# EAGLE design led_driver_v1.1 (EAGLE 7.1.0)
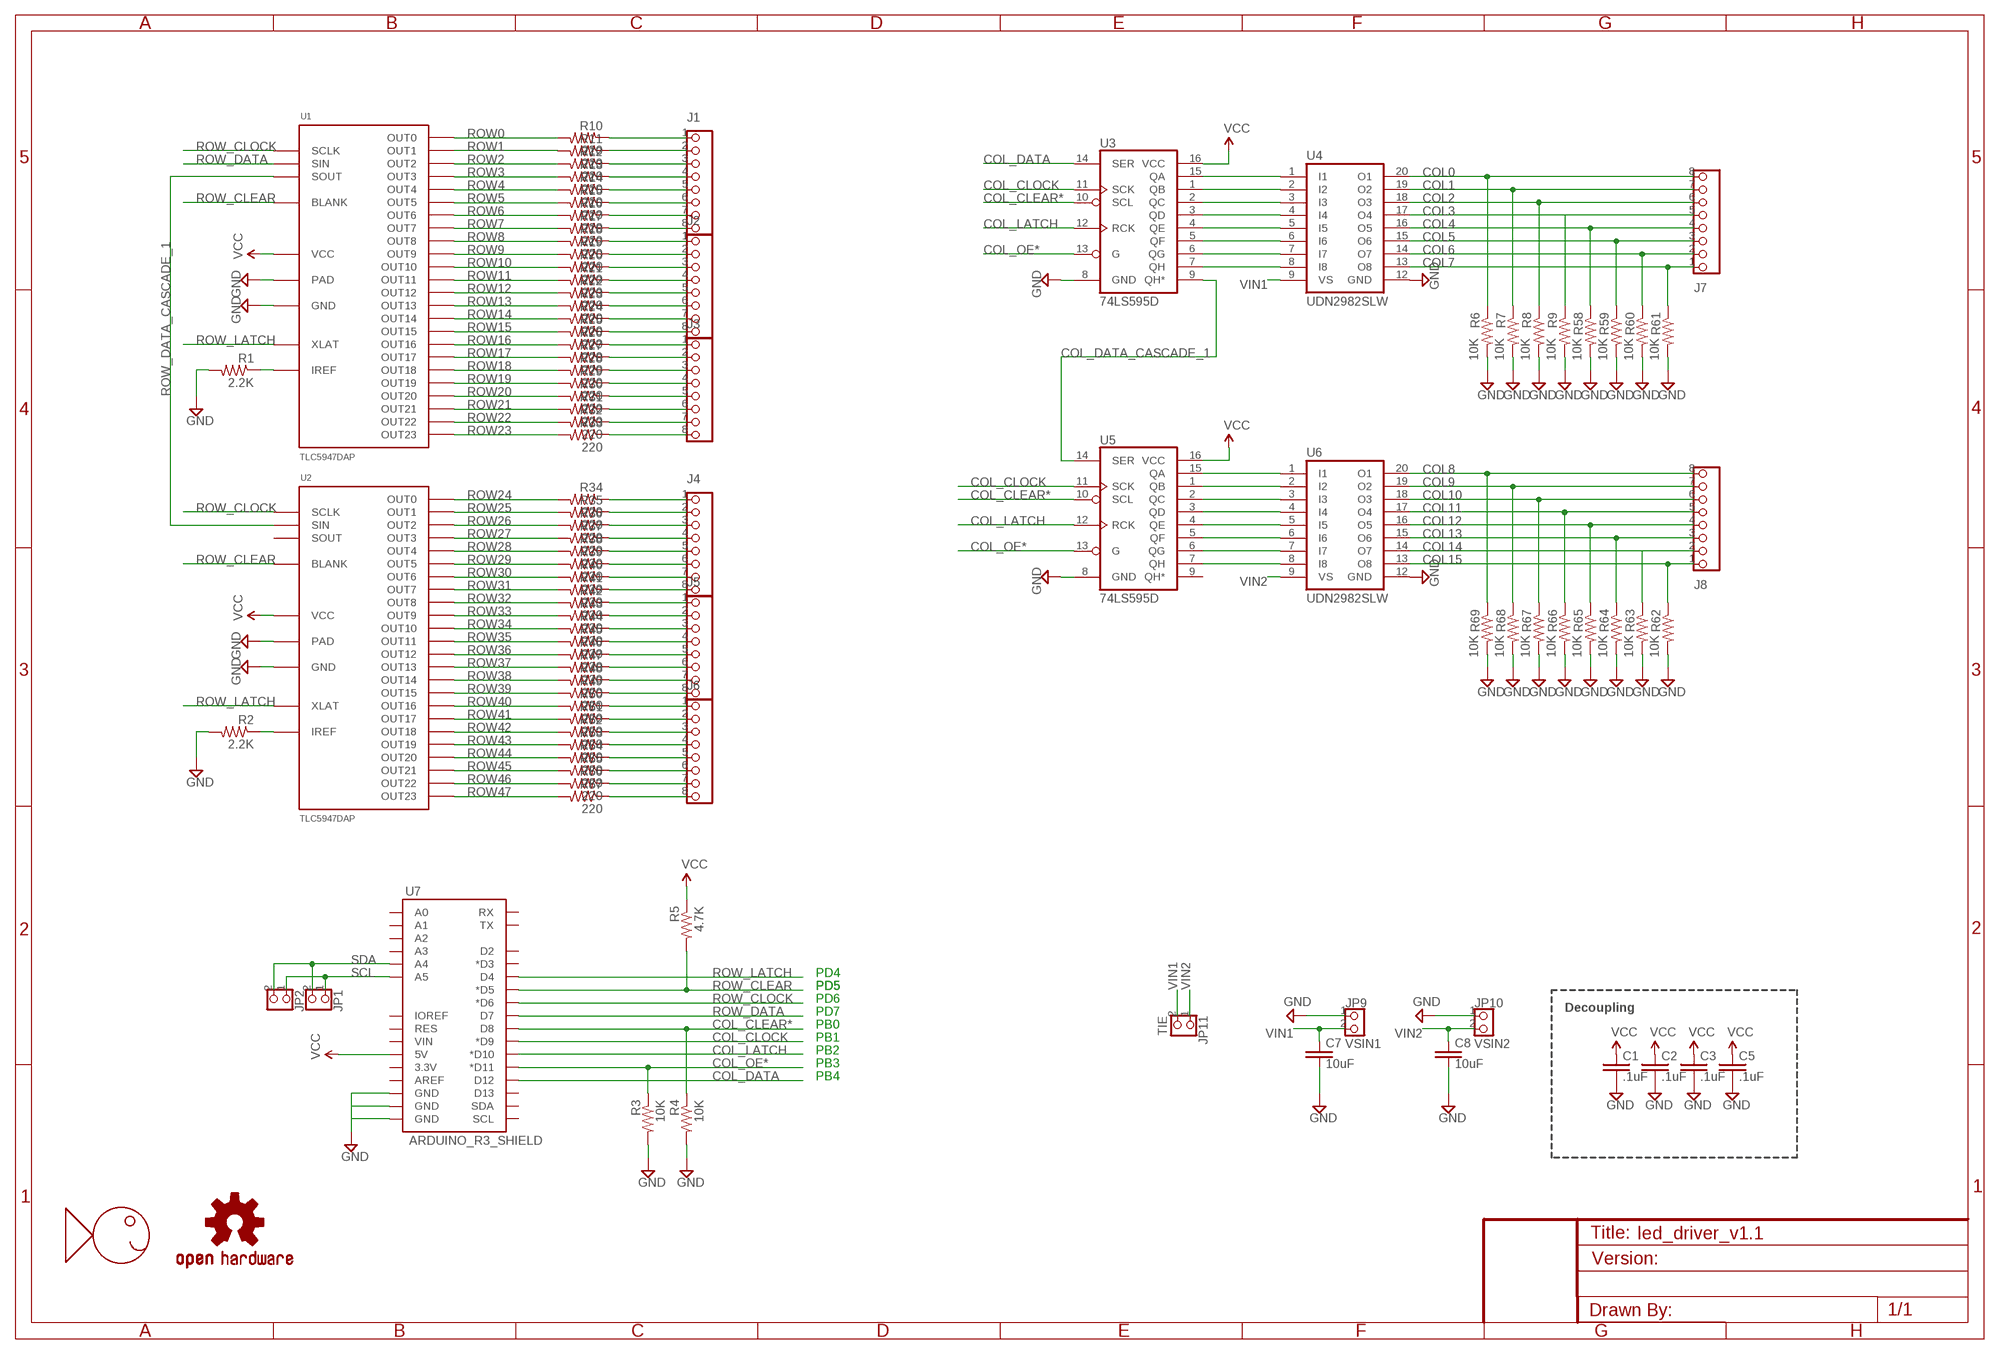
[diagram p0: schematic, sheet 1]

## Parts
C1  .1uF  CAPACITORC0603  [C0603]
C2  .1uF  CAPACITORC0603  [C0603]
C3  .1uF  CAPACITORC0603  [C0603]
C5  .1uF  CAPACITORC0603  [C0603]
C7  10uF  CAPACITORC0603  [C0603]
C8  10uF  CAPACITORC0603  [C0603]
J1  PINHD-1X8  [1X08]
J2  PINHD-1X8  [1X08]
J3  PINHD-1X8  [1X08]
J4  PINHD-1X8  [1X08]
J5  PINHD-1X8  [1X08]
J6  PINHD-1X8  [1X08]
J7  PINHD-1X8  [1X08]
J8  PINHD-1X8  [1X08]
JP1  PINHD-1X2  [1X02]
JP2  PINHD-1X2  [1X02]
JP9  VSIN1  PINHD-1X2  [1X02]
JP10  VSIN2  PINHD-1X2  [1X02]
JP11  TIE  PINHD-1X2  [1X02]
LOGO1  OSHW-LOGOS  [OSHW-LOGO-S]
R1  2.2K  RESISTOR_SMD0603-RES  [0603-RES]
R2  2.2K  RESISTOR_SMD0603-RES  [0603-RES]
R3  10K  RESISTOR_SMD0603-RES  [0603-RES]
R4  10K  RESISTOR_SMD0603-RES  [0603-RES]
R5  4.7K  RESISTOR_SMD0603-RES  [0603-RES]
R6  10K  RESISTOR_SMD0603-RES  [0603-RES]
R7  10K  RESISTOR_SMD0603-RES  [0603-RES]
R8  10K  RESISTOR_SMD0603-RES  [0603-RES]
R9  10K  RESISTOR_SMD0603-RES  [0603-RES]
R10  220  RESISTOR_SMD0603-RES  [0603-RES]
R11  220  RESISTOR_SMD0603-RES  [0603-RES]
R12  220  RESISTOR_SMD0603-RES  [0603-RES]
R13  220  RESISTOR_SMD0603-RES  [0603-RES]
R14  220  RESISTOR_SMD0603-RES  [0603-RES]
R15  220  RESISTOR_SMD0603-RES  [0603-RES]
R16  220  RESISTOR_SMD0603-RES  [0603-RES]
R17  220  RESISTOR_SMD0603-RES  [0603-RES]
R18  220  RESISTOR_SMD0603-RES  [0603-RES]
R19  220  RESISTOR_SMD0603-RES  [0603-RES]
R20  220  RESISTOR_SMD0603-RES  [0603-RES]
R21  220  RESISTOR_SMD0603-RES  [0603-RES]
R22  220  RESISTOR_SMD0603-RES  [0603-RES]
R23  220  RESISTOR_SMD0603-RES  [0603-RES]
R24  220  RESISTOR_SMD0603-RES  [0603-RES]
R25  220  RESISTOR_SMD0603-RES  [0603-RES]
R26  220  RESISTOR_SMD0603-RES  [0603-RES]
R27  220  RESISTOR_SMD0603-RES  [0603-RES]
R28  220  RESISTOR_SMD0603-RES  [0603-RES]
R29  220  RESISTOR_SMD0603-RES  [0603-RES]
R30  220  RESISTOR_SMD0603-RES  [0603-RES]
R31  220  RESISTOR_SMD0603-RES  [0603-RES]
R32  220  RESISTOR_SMD0603-RES  [0603-RES]
R33  220  RESISTOR_SMD0603-RES  [0603-RES]
R34  220  RESISTOR_SMD0603-RES  [0603-RES]
R35  220  RESISTOR_SMD0603-RES  [0603-RES]
R36  220  RESISTOR_SMD0603-RES  [0603-RES]
R37  220  RESISTOR_SMD0603-RES  [0603-RES]
R38  220  RESISTOR_SMD0603-RES  [0603-RES]
R39  220  RESISTOR_SMD0603-RES  [0603-RES]
R40  220  RESISTOR_SMD0603-RES  [0603-RES]
R41  220  RESISTOR_SMD0603-RES  [0603-RES]
R42  220  RESISTOR_SMD0603-RES  [0603-RES]
R43  220  RESISTOR_SMD0603-RES  [0603-RES]
R44  220  RESISTOR_SMD0603-RES  [0603-RES]
R45  220  RESISTOR_SMD0603-RES  [0603-RES]
R46  220  RESISTOR_SMD0603-RES  [0603-RES]
R47  220  RESISTOR_SMD0603-RES  [0603-RES]
R48  220  RESISTOR_SMD0603-RES  [0603-RES]
R49  220  RESISTOR_SMD0603-RES  [0603-RES]
R50  220  RESISTOR_SMD0603-RES  [0603-RES]
R51  220  RESISTOR_SMD0603-RES  [0603-RES]
R52  220  RESISTOR_SMD0603-RES  [0603-RES]
R53  220  RESISTOR_SMD0603-RES  [0603-RES]
R54  220  RESISTOR_SMD0603-RES  [0603-RES]
R55  220  RESISTOR_SMD0603-RES  [0603-RES]
R56  220  RESISTOR_SMD0603-RES  [0603-RES]
R57  220  RESISTOR_SMD0603-RES  [0603-RES]
R58  10K  RESISTOR_SMD0603-RES  [0603-RES]
R59  10K  RESISTOR_SMD0603-RES  [0603-RES]
R60  10K  RESISTOR_SMD0603-RES  [0603-RES]
R61  10K  RESISTOR_SMD0603-RES  [0603-RES]
R62  10K  RESISTOR_SMD0603-RES  [0603-RES]
R63  10K  RESISTOR_SMD0603-RES  [0603-RES]
R64  10K  RESISTOR_SMD0603-RES  [0603-RES]
R65  10K  RESISTOR_SMD0603-RES  [0603-RES]
R66  10K  RESISTOR_SMD0603-RES  [0603-RES]
R67  10K  RESISTOR_SMD0603-RES  [0603-RES]
R68  10K  RESISTOR_SMD0603-RES  [0603-RES]
R69  10K  RESISTOR_SMD0603-RES  [0603-RES]
U1  TLC5947DAP  [HTSSOP32DAP]
U2  TLC5947DAP  [HTSSOP32DAP]
U3  74LS595D  [SO16]
U4  UDN2982SLW  [SO20W]
U5  74LS595D  [SO16]
U6  UDN2982SLW  [SO20W]
U7  ARDUINO_R3_SHIELD  [UNO_R3_SHIELD]
U$1  FHI_LOGO  [FHI_LOGO]

## Nets
COL0: J7.8 R6.1 U4.20(O1)
COL1: J7.7 R7.1 U4.19(O2)
COL2: J7.6 R8.1 U4.18(O3)
COL3: J7.5 R9.1 U4.17(O4)
COL4: J7.4 R58.1 U4.16(O5)
COL5: J7.3 R59.1 U4.15(O6)
COL6: J7.2 R60.1 U4.14(O7)
COL7: J7.1 R61.1 U4.13(O8)
COL8: J8.8 R69.1 U6.20(O1)
COL9: J8.7 R68.1 U6.19(O2)
COL10: J8.6 R67.1 U6.18(O3)
COL11: J8.5 R66.1 U6.17(O4)
COL12: J8.4 R65.1 U6.16(O5)
COL13: J8.3 R64.1 U6.15(O6)
COL14: J8.2 R63.1 U6.14(O7)
COL15: J8.1 R62.1 U6.13(O8)
COL_CLEAR*: R4.1 U3.10(SCL) U5.10(SCL) U7.D8
COL_CLOCK: U3.11(SCK) U5.11(SCK) U7.D9(*D9)
COL_DATA: U3.14(SER) U7.D12
COL_DATA_CASCADE_1: U3.9(QH*) U5.14(SER)
COL_LATCH: U3.12(RCK) U5.12(RCK) U7.D10(*D10)
COL_OE*: R3.1 U3.13(G) U5.13(G) U7.D11(*D11)
GND: C1.2 C2.2 C3.2 C5.2 C7.2 C8.2 JP9.1 JP10.1 R1.2 R2.2 R3.2 R4.2 R6.2 R7.2 R8.2 R9.2 R58.2 R59.2 R60.2 R61.2 R62.2 R63.2 R64.2 R65.2 R66.2 R67.2 R68.2 R69.2 U1.1(GND) U1.EXP(PAD) U2.1(GND) U2.EXP(PAD) U3.8(GND) U4.12(GND) U5.8(GND) U6.12(GND) U7.GND@0(GND) U7.GND@1(GND) U7.GND@2(GND)
N$1: U3.15(QA) U4.1(I1)
N$2: U3.1(QB) U4.2(I2)
N$3: U3.2(QC) U4.3(I3)
N$4: U3.3(QD) U4.4(I4)
N$5: U3.4(QE) U4.5(I5)
N$6: U3.5(QF) U4.6(I6)
N$7: U3.6(QG) U4.7(I7)
N$8: U3.7(QH) U4.8(I8)
N$9: J1.1 R10.1
N$10: U5.15(QA) U6.1(I1)
N$11: U5.1(QB) U6.2(I2)
N$12: U5.2(QC) U6.3(I3)
N$13: U5.3(QD) U6.4(I4)
N$14: U5.4(QE) U6.5(I5)
N$15: U5.5(QF) U6.6(I6)
N$16: U5.6(QG) U6.7(I7)
N$17: U5.7(QH) U6.8(I8)
N$19: J1.7 R16.1
N$20: J1.8 R17.1
N$21: J2.1 R18.1
N$22: J2.2 R19.1
N$23: J2.3 R20.1
N$24: J1.6 R15.1
N$25: J2.4 R21.1
N$26: J2.5 R22.1
N$27: J2.6 R23.1
N$28: R2.1 U2.31(IREF)
N$29: J2.7 R24.1
N$30: J2.8 R25.1
N$31: J3.1 R26.1
N$32: J3.2 R27.1
N$33: J3.3 R28.1
N$34: J3.4 R29.1
N$35: R1.1 U1.31(IREF)
N$36: J3.5 R30.1
N$37: J3.6 R31.1
N$38: J3.7 R32.1
N$39: J3.8 R33.1
N$40: J1.2 R11.1
N$41: J1.3 R12.1
N$42: J1.4 R13.1
N$43: J1.5 R14.1
N$44: J6.7 R56.1
N$45: J6.8 R57.1
N$46: J6.6 R55.1
N$47: J6.5 R54.1
N$48: J6.4 R53.1
N$49: J6.3 R52.1
N$50: J6.2 R51.1
N$51: J6.1 R50.1
N$52: J5.8 R49.1
N$53: J5.7 R48.1
N$54: J5.6 R47.1
N$55: J5.5 R46.1
N$56: J5.4 R45.1
N$57: J5.3 R44.1
N$58: J5.2 R43.1
N$59: J5.1 R42.1
N$60: J4.8 R41.1
N$61: J4.7 R40.1
N$62: J4.6 R39.1
N$63: J4.5 R38.1
N$64: J4.4 R37.1
N$65: J4.3 R36.1
N$66: J4.2 R35.1
N$67: J4.1 R34.1
ROW0: R10.2 U1.5(OUT0)
ROW1: R11.2 U1.6(OUT1)
ROW2: R12.2 U1.7(OUT2)
ROW3: R13.2 U1.8(OUT3)
ROW4: R14.2 U1.9(OUT4)
ROW5: R15.2 U1.10(OUT5)
ROW6: R16.2 U1.11(OUT6)
ROW7: R17.2 U1.12(OUT7)
ROW8: R18.2 U1.13(OUT8)
ROW9: R19.2 U1.14(OUT9)
ROW10: R20.2 U1.15(OUT10)
ROW11: R21.2 U1.16(OUT11)
ROW12: R22.2 U1.17(OUT12)
ROW13: R23.2 U1.18(OUT13)
ROW14: R24.2 U1.19(OUT14)
ROW15: R25.2 U1.20(OUT15)
ROW16: R26.2 U1.21(OUT16)
ROW17: R27.2 U1.22(OUT17)
ROW18: R28.2 U1.23(OUT18)
ROW19: R29.2 U1.24(OUT19)
ROW20: R30.2 U1.25(OUT20)
ROW21: R31.2 U1.26(OUT21)
ROW22: R32.2 U1.27(OUT22)
ROW23: R33.2 U1.28(OUT23)
ROW24: R34.2 U2.5(OUT0)
ROW25: R35.2 U2.6(OUT1)
ROW26: R36.2 U2.7(OUT2)
ROW27: R37.2 U2.8(OUT3)
ROW28: R38.2 U2.9(OUT4)
ROW29: R39.2 U2.10(OUT5)
ROW30: R40.2 U2.11(OUT6)
ROW31: R41.2 U2.12(OUT7)
ROW32: R42.2 U2.13(OUT8)
ROW33: R43.2 U2.14(OUT9)
ROW34: R44.2 U2.15(OUT10)
ROW35: R45.2 U2.16(OUT11)
ROW36: R46.2 U2.17(OUT12)
ROW37: R47.2 U2.18(OUT13)
ROW38: R48.2 U2.19(OUT14)
ROW39: R49.2 U2.20(OUT15)
ROW40: R50.2 U2.21(OUT16)
ROW41: R51.2 U2.22(OUT17)
ROW42: R52.2 U2.23(OUT18)
ROW43: R53.2 U2.24(OUT19)
ROW44: R54.2 U2.25(OUT20)
ROW45: R55.2 U2.26(OUT21)
ROW46: R56.2 U2.27(OUT22)
ROW47: R57.2 U2.28(OUT23)
ROW_CLEAR: R5.2 U1.2(BLANK) U2.2(BLANK) U7.D5(*D5)
ROW_CLOCK: U1.3(SCLK) U2.3(SCLK) U7.D6(*D6)
ROW_DATA: U1.4(SIN) U7.D7
ROW_DATA_CASCADE_1: U1.29(SOUT) U2.4(SIN)
ROW_LATCH: U1.30(XLAT) U2.30(XLAT) U7.D4
SCL: JP1.1 JP2.1 U7.A5
SDA: JP1.2 JP2.2 U7.A4
VCC: C1.1 C2.1 C3.1 C5.1 R5.1 U1.32(VCC) U2.32(VCC) U3.16(VCC) U5.16(VCC) U7.5V
VIN1: C7.1 JP9.2 JP11.2 U4.9(VS)
VIN2: C8.1 JP10.2 JP11.1 U6.9(VS)
Unconnected: U2.29(SOUT) U5.9(QH*) U7.3.3V U7.A0 U7.A1 U7.A2 U7.A3 U7.AREF U7.D2 U7.D3(*D3) U7.D13 U7.IOREF U7.RES U7.RX U7.SCL U7.SDA U7.TX U7.VIN

## Notes on the sheet
- PD4
- PD5 | PD5
- PD6 | Decoupling
- PD7
- PB0
- PB1
- PB2
- PB3
- PB4

## Library data of the parts
C1-C3 C5 C7 C8 = CyberRailGuru:CAPACITOR: CAPACITOR, American symbol
J1-J8 = CyberRailGuru:PINHD-1X8: PIN HEADER
JP1 JP2 JP9-JP11 = CyberRailGuru:PINHD-1X2: PIN HEADER
LOGO1 = SparkFun-Aesthetics:OSHW-LOGO: Open Source Hardware Logo This logo indicates the piece of hardware it is found on incorporates a OSHW license and/or adheres to the definition of open source hardware found here: http://freedomdefined.org/OSHW
R1-R69 = CyberRailGuru:RESISTOR_SMD: Resistor Basic schematic elements and footprints for 0603, 1206, and PTH resistors.
U1 U2 = CyberRailGuru:TLC5947
U3 U5 = CyberRailGuru:74*595: 8-bit SHIFT REGISTER, output latch; PROD_ID: IC-07875
U4 U6 = CyberRailGuru:UDN298*: DRIVER ARRAY Source: Allegro Microsystems Inc. / UDN2981-UDN2984.pdf
U7 = CyberRailGuru:ARDUINO_R3_SHIELD: Shield form compatible with the Arduino Uno R3.
U$1 = CyberRailGuru:FHI_LOGO: Fishhead Industries Logo

## Board
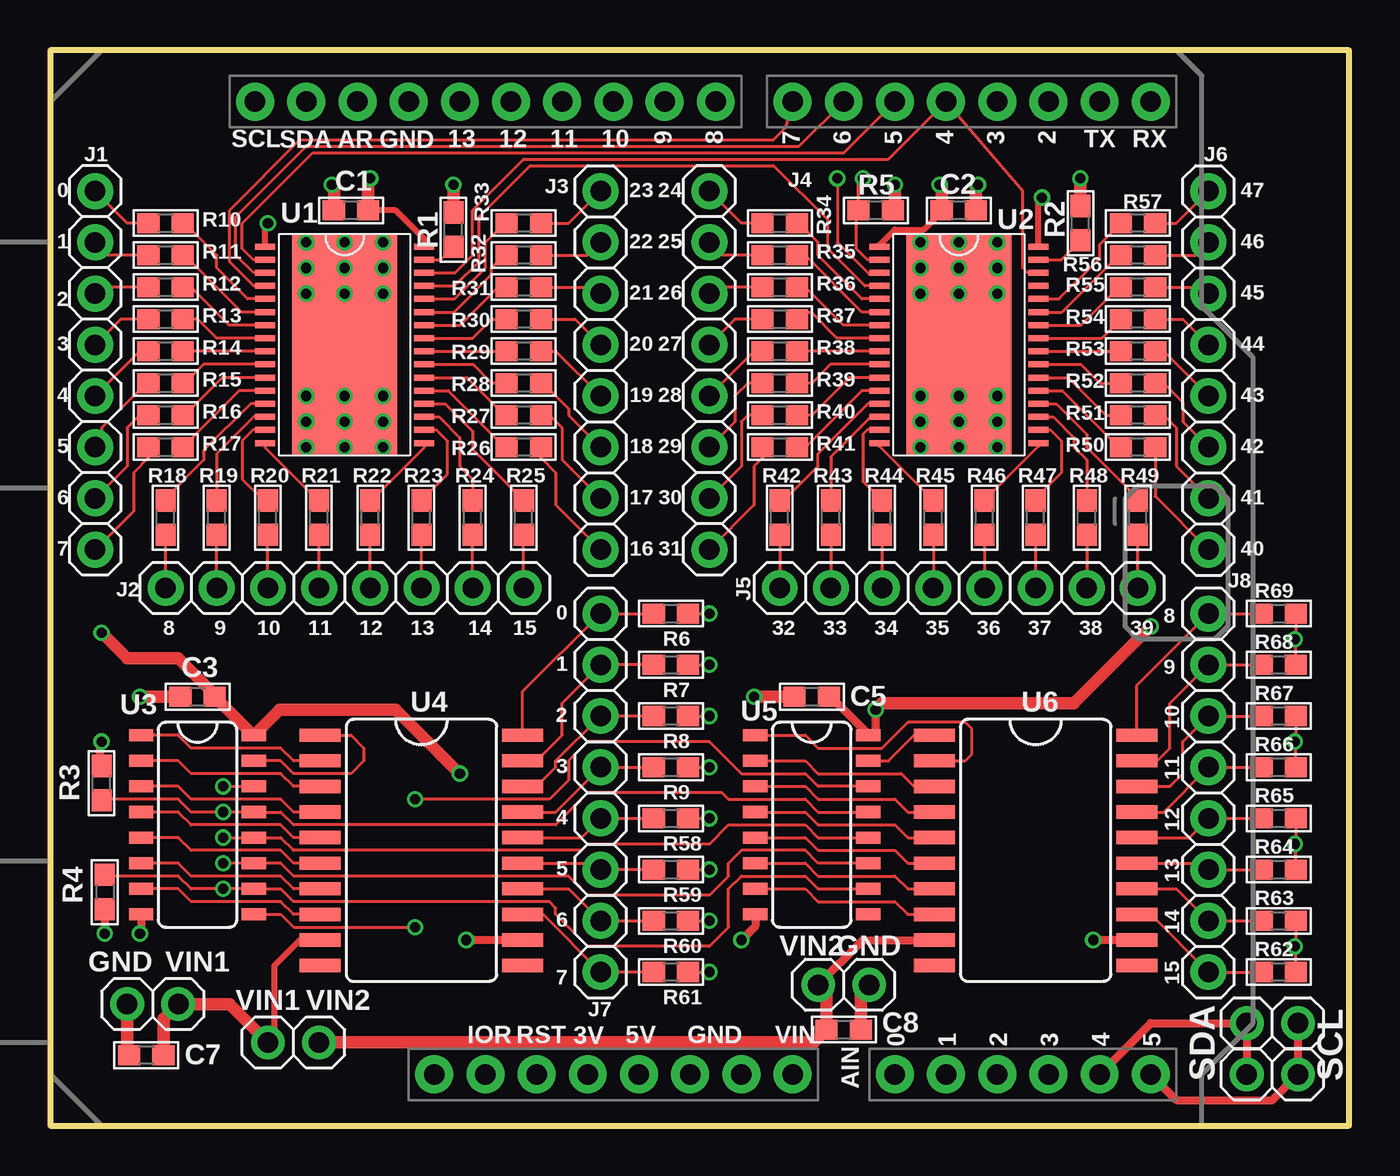
[diagram p1: board, top side]
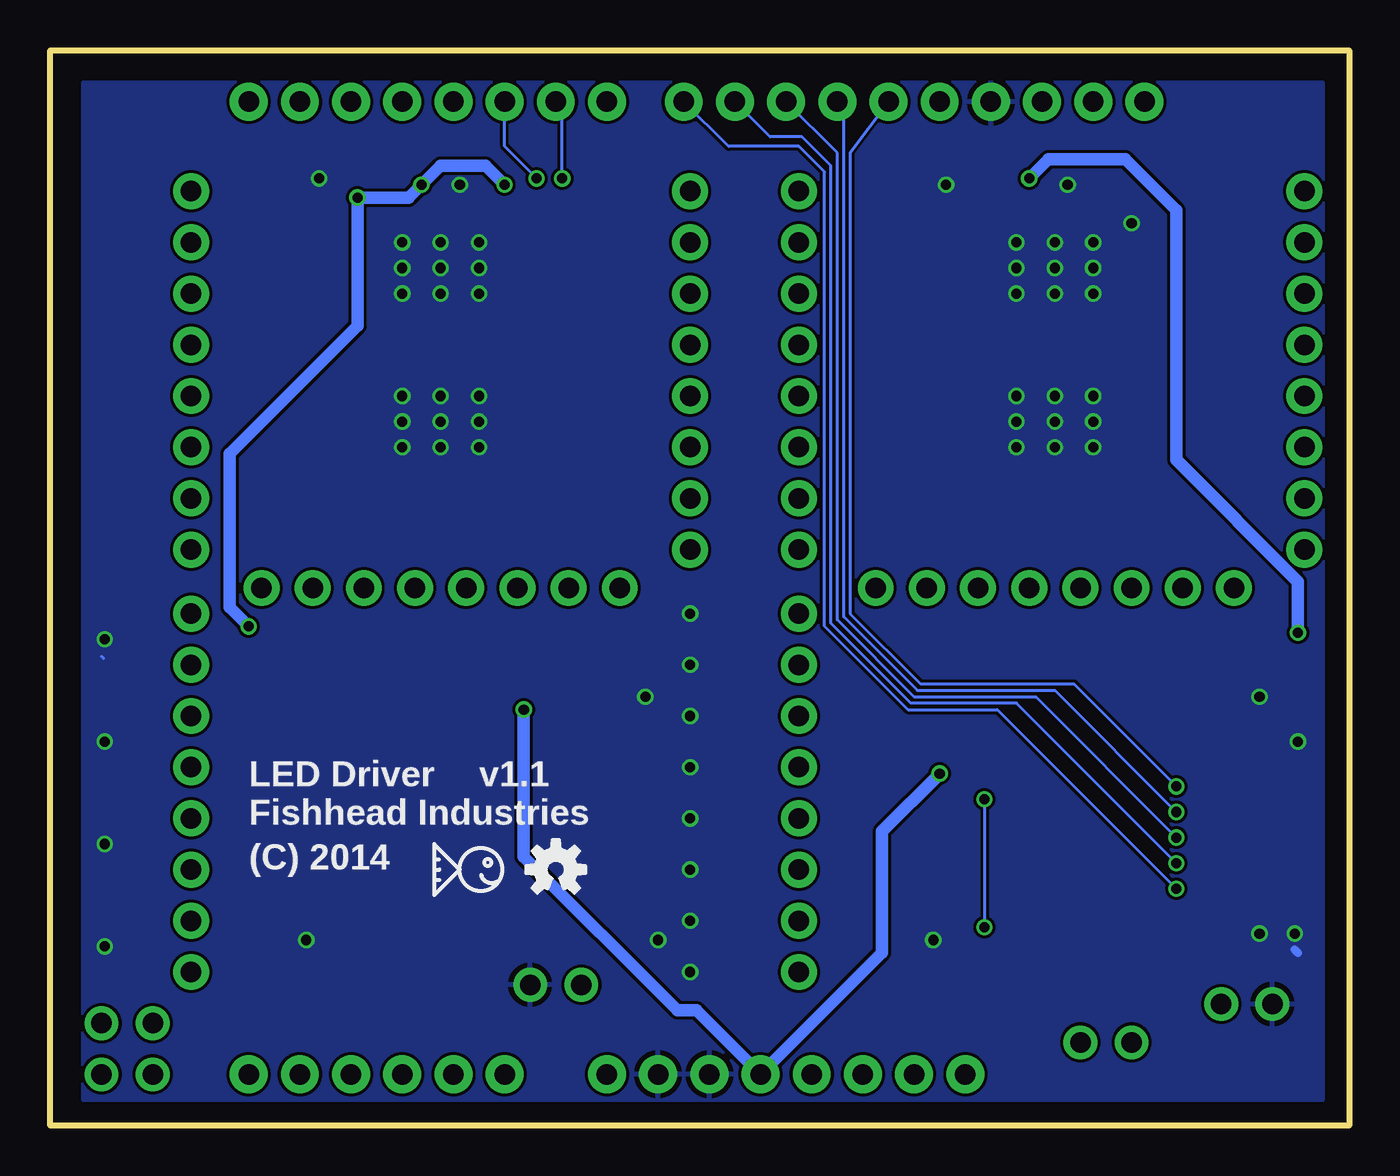
[diagram p2: board, bottom side, seen from below]

Size 64.45 x 53.34 mm. Coordinates in mm from the lower left corner, seen from the top.
Outline: 0,0 64.45,0 64.45,53.34 0,53.34 0,0
Copper layers (1*16): Top 0.035mm / dielectric 1.5mm / Bottom 0.035mm
Design rules "Fusion_eagle_rule_v1.1_tms *": minimum track width 6mil, minimum drill 12mil, track to track 6mil, track to pad 6mil, pad to pad 6mil, via to via 10mil, smd to smd 0mil, copper to edge 15mil, drill to drill 15mil, minimum pad ring 10mil, minimum via ring 6mil, stop-mask expansion 2mil, vias tented up to drill 100mil, thermal gap 10mil

### Footprints (pad centres in the part's own frame; a part is rotated, then mirrored left to right if it is on the bottom)
C0603 = smd 1.1 x 1: 1 -0.85,0; 2 0.85,0
1X08 = drill 1.016 pad 1.778: 1 -8.89,0; 2 -6.35,0; 3 -3.81,0; 4 -1.27,0; 5 1.27,0; 6 3.81,0; 7 6.35,0; 8 8.89,0
1X02 = drill 1.016 pad 1.676: 1 -1.27,0; 2 1.27,0
0603-RES = smd 1.1 x 1: 1 -0.85,0; 2 0.85,0
HTSSOP32DAP = smd 0.3 x 1: 1 -4.875,-3.95; 2 -4.225,-3.95; 3 -3.575,-3.95; 4 -2.925,-3.95; 5 -2.275,-3.95; 6 -1.625,-3.95; 7 -0.975,-3.95; 8 -0.325,-3.95; 9 0.325,-3.95; 10 0.975,-3.95; 11 1.625,-3.95; 12 2.275,-3.95; 13 2.925,-3.95; 14 3.575,-3.95; 15 4.225,-3.95; 16 4.875,-3.95; 17 4.875,3.95; 18 4.225,3.95; 19 3.575,3.95; 20 2.925,3.95; 21 2.275,3.95; 22 1.625,3.95; 23 0.975,3.95; 24 0.325,3.95; 25 -0.325,3.95; 26 -0.975,3.95; 27 -1.625,3.95; 28 -2.275,3.95; 29 -2.925,3.95; 30 -3.575,3.95; 31 -4.225,3.95; 32 -4.875,3.95 | smd 11 x 5.2: EXP 0,0
SO16 = smd 0.6 x 1.2: 1 -4.445,-2.8; 2 -3.175,-2.8; 3 -1.905,-2.8; 4 -0.635,-2.8; 5 0.635,-2.8; 6 1.905,-2.8; 7 3.175,-2.8; 8 4.445,-2.8; 9 4.445,2.8; 10 3.175,2.8; 11 1.905,2.8; 12 0.635,2.8; 13 -0.635,2.8; 14 -1.905,2.8; 15 -3.175,2.8; 16 -4.445,2.8
SO20W = smd 0.66 x 2.032: 1 -5.715,-5.029; 2 -4.445,-5.029; 3 -3.175,-5.029; 4 -1.905,-5.029; 5 -0.635,-5.029; 6 0.635,-5.029; 7 1.905,-5.029; 8 3.175,-5.029; 9 4.445,-5.029; 10 5.715,-5.029; 11 5.715,5.029; 12 4.445,5.029; 13 3.175,5.029; 14 1.905,5.029; 15 0.635,5.029; 16 -0.635,5.029; 17 -1.905,5.029; 18 -3.175,5.029; 19 -4.445,5.029; 20 -5.715,5.029
UNO_R3_SHIELD = drill 1.016 pad 1.88: 3.3V 50.8,26.67; 5V 50.8,29.21; A0 50.8,41.91; A1 50.8,44.45; A2 50.8,46.99; A3 50.8,49.53; A4 50.8,52.07; A5 50.8,54.61; AREF 2.54,15.24; D2 2.54,49.53; D3 2.54,46.99; D4 2.54,44.45; D5 2.54,41.91; D6 2.54,39.37; D7 2.54,36.83; D8 2.54,33.02; D9 2.54,30.48; D10 2.54,27.94; D11 2.54,25.4; D12 2.54,22.86; D13 2.54,20.32; GND@0 50.8,31.75; GND@1 50.8,34.29; GND@2 2.54,17.78; IOREF 50.8,21.59; NC 50.8,19.05; RES 50.8,24.13; RX 2.54,54.61; SCL 2.54,10.16; SDA 2.54,12.7; TX 2.54,52.07; VIN 50.8,36.83

### Placement (x,y rotation side)
C1  14.92,45.4 180 top
C2  45.09,45.4 180 top
C3  7.3,21.27 180 top
C5  37.78,21.27 180 top
C7  4.76,3.49 180 top
C8  39.37,4.76 0 top
J1  2.22,37.47 270 top
J2  14.61,26.67 0 top
J3  27.3,37.47 90 top
J4  32.7,37.47 270 top
J5  45.09,26.67 0 top
J6  57.47,37.47 90 top
J7  27.3,16.51 90 top
J8  57.47,16.51 90 top
JP1  60.64,5.08 180 top
JP2  60.64,2.54 180 top
JP9  5.08,6.03 0 top
JP10  39.37,6.99 180 top
JP11  12.06,4.13 180 top
LOGO1  39.37,12.7 0 bottom
R1  20,44.45 90 top
R2  51.12,44.77 90 top
R3  2.54,16.99 90 top
R4  2.7,11.59 270 top
R5  40.96,45.4 180 top
R6  30.8,25.4 0 top
R7  30.8,22.86 0 top
R8  30.8,20.32 0 top
R9  30.8,17.78 0 top
R10  5.71,44.77 0 top
R11  5.71,43.18 0 top
R12  5.71,41.59 0 top
R13  5.71,40.01 0 top
R14  5.71,38.42 0 top
R15  5.71,36.83 0 top
R16  5.71,35.24 0 top
R17  5.71,33.66 0 top
R18  5.71,30.16 90 top
R19  8.26,30.16 90 top
R20  10.79,30.16 90 top
R21  13.34,30.16 90 top
R22  15.88,30.16 90 top
R23  18.41,30.16 90 top
R24  20.95,30.16 90 top
R25  23.5,30.16 90 top
R26  23.5,33.66 180 top
R27  23.5,35.24 180 top
R28  23.5,36.83 180 top
R29  23.5,38.42 180 top
R30  23.5,40.01 180 top
R31  23.5,41.59 180 top
R32  23.5,43.18 180 top
R33  23.5,44.77 180 top
R34  36.2,44.77 0 top
R35  36.2,43.18 0 top
R36  36.2,41.59 0 top
R37  36.2,40.01 0 top
R38  36.2,38.42 0 top
R39  36.2,36.83 0 top
R40  36.2,35.24 0 top
R41  36.2,33.66 0 top
R42  36.2,30.16 90 top
R43  38.73,30.16 90 top
R44  41.27,30.16 90 top
R45  43.81,30.16 90 top
R46  46.35,30.16 90 top
R47  48.9,30.16 90 top
R48  51.44,30.16 90 top
R49  53.98,30.16 90 top
R50  53.98,33.66 180 top
R51  53.98,35.24 180 top
R52  53.98,36.83 180 top
R53  53.98,38.42 180 top
R54  53.98,40.01 180 top
R55  53.98,41.59 180 top
R56  53.98,43.18 180 top
R57  53.98,44.77 180 top
R58  30.8,15.24 0 top
R59  30.8,12.7 0 top
R60  30.8,10.16 0 top
R61  30.8,7.62 0 top
R62  60.96,7.62 0 top
R63  60.96,10.16 0 top
R64  60.96,12.7 0 top
R65  60.96,15.24 0 top
R66  60.96,17.78 0 top
R67  60.96,20.32 0 top
R68  60.96,22.86 0 top
R69  60.96,25.4 0 top
U1  14.61,38.73 270 top
U2  45.09,38.73 270 top
U3  7.3,14.92 270 top
U4  18.41,13.65 270 top
U5  37.78,14.92 270 top
U6  48.9,13.65 270 top
U7  0,53.34 270 top
U$1  44.13,12.7 0 bottom

### Tracks (layer width: path | path; a pad name or v marks a point on that pad's centre or on a via)
COL0
  Top 0.152: R6.1 J7.8 23.44,21.54 U4.20
COL1
  Top 0.152: R7.1 J7.7 25.4,20.95 25.4,19.37 24.13,18.1 U4.19
COL2
  Top 0.152: R8.1 J7.6 25.08,18.1 25.08,17.78 24.13,16.83 U4.18
COL3
  Top 0.152: R9.1 J7.5 25.08,15.56 U4.17
COL4
  Top 0.152: R58.1 J7.4 26.35,14.29 U4.16
COL5
  Top 0.152: R59.1 J7.3 26.99,13.02 U4.15
COL6
  Top 0.152: R60.1 J7.2 25.72,11.75 U4.14
COL7
  Top 0.152: R61.1 J7.1 24.45,10.48 U4.13
COL8
  Top 0.152: R69.1 J8.8 53.92,21.86 U6.20
COL9
  Top 0.152: R68.1 J8.7 55.56,20.95 55.56,18.73 54.93,18.1 U6.19
COL10
  Top 0.152: R67.1 J8.6 56.2,19.05 56.2,17.46 55.56,16.83 U6.18
COL11
  Top 0.152: R66.1 J8.5 55.24,15.56 U6.17
COL12
  Top 0.152: R65.1 J8.4 56.52,14.29 U6.16
COL13
  Top 0.152: R64.1 J8.3 57.15,13.02 U6.15
COL14
  Top 0.152: R63.1 J8.2 55.88,11.75 U6.14
COL15
  Top 0.152: R62.1 J8.1 54.61,10.48 U6.13
COL_CLEAR*  (via drill 0.5)
  Top 0.152: U5.10 38.1,11.75 37.47,12.38 34.29,12.38 33.66,11.75 33.66,9.84 32.7,8.89 26.67,8.89 25.08,10.48 25.08,10.79 24.77,11.11 12.06,11.11 11.43,11.75 U3.10 v8.57,11.75 6.99,11.75 6.35,12.38 2.75,12.38 R4.1
  Bottom 0.152: v8.57,11.75 17.46,20.64 21.91,20.64 26.04,24.77 26.04,47.31 27.3,48.58 30.8,48.58 U7.D8
COL_CLOCK  (via drill 0.5)
  Top 0.152: v8.57,13.02 U3.11 11.43,13.02 12.06,12.38 25.72,12.38 26.67,11.43 32.7,11.43 33.66,12.38 33.66,13.02 34.29,13.65 37.47,13.65 38.1,13.02 U5.11
  Bottom 0.152: v8.57,13.02 16.51,20.95 21.75,20.95 25.72,24.92 25.72,47.62 27.15,49.05 28.73,49.05 U7.D9
COL_DATA  (via drill 0.5)
  Top 0.152: v8.57,16.83 U3.14
  Bottom 0.152: v8.57,16.83 13.65,21.91 21.27,21.91 24.77,25.4 24.77,48.26 U7.D12
COL_DATA_CASCADE_1  (via drill 0.5)
  Top 0.152: U3.9 11.43,10.48 12.06,9.84 v18.1,9.84 | U5.14 38.1,16.83 37.47,17.46 34.29,17.46 32.7,19.05 26.67,19.05 25.72,18.1 25.72,17.14 24.77,16.19 v18.1,16.19
  Bottom 0.152: v18.1,16.19 v18.1,9.84
COL_LATCH  (via drill 0.5)
  Top 0.152: v8.57,14.29 U3.12 11.43,14.29 12.06,13.65 26.35,13.65 26.67,13.97 32.7,13.97 33.66,14.92 37.47,14.92 38.1,14.29 U5.12
  Bottom 0.152: v8.57,14.29 15.56,21.27 21.59,21.27 25.4,25.08 25.4,48.26 U7.D10
COL_OE*  (via drill 0.5)
  Top 0.152: U5.13 38.1,15.56 37.47,16.19 33.66,16.19 33.34,16.51 26.67,16.51 25.08,14.92 12.06,14.92 11.43,15.56 U3.13 v8.57,15.56 6.99,15.56 6.35,16.19 2.6,16.19 R3.1
  Bottom 0.152: v8.57,15.56 14.61,21.59 21.43,21.59 25.08,25.24 25.08,50.48 U7.D11
GND  (via drill 0.5)
  Top 0.152: 14.61,41.91 v12.7,43.81 | 3.81,3.6 C7.2 | R65.2 61.81,14.03 v61.75,13.97 61.81,13.91 R64.2 | R63.2 61.81,8.95 v61.75,8.89 61.81,8.83 R62.2 | R66.2 61.81,18.99 v61.75,19.05 61.81,19.11 R67.2 | R68.2 61.81,24.07 v61.75,24.13 61.81,24.19 R69.2 | R61.2 v32.7,7.62 | R60.2 v32.7,10.16 | R59.2 v32.7,12.7 | R58.2 v32.7,15.24 | R9.2 v32.7,17.78 | R8.2 v32.7,20.32 | R7.2 v32.7,22.86 | R6.2 v32.7,25.4
  Top 0.305: R4.2 2.64,10.53 | R3.2 2.48,17.84 | U1.1 10.65,44.63 v10.79,44.77 | U2.1 41.13,43.67 41.91,44.45 43.34,44.45 44.23,45.35 C2.2
  Top 0.406: U4.12 v20.64,9.21 | U5.8 34.98,9.9 v34.29,9.21 | U6.12 v51.75,9.21 | 2.48,17.84 2.48,18.99 v2.54,19.05 | U3.8 4.5,9.58 v4.45,9.53 | R4.2 v2.7,9.53
  Top 0.61: 3.81,3.6 JP9.1 | C8.2 40.22,6.57 JP10.1 | C5.2 v34.92,21.27 | C1.2 14.07,46.57 v13.97,46.67 | R1.2 v20,46.67 | C3.2 v4.45,21.27 | R2.2 v51.12,46.99 | C2.2 44.23,46.57 v44.13,46.67 | U2.EXP v45.09,41.27 | U1.EXP v14.61,41.27
  Bottom 0.152: 61.91,23.28 61.81,23.18
  Bottom 0.406: 2.7,8.73 2.54,8.57
  other vias: 12.7,42.55 14.61,43.81 16.51,43.81 16.51,42.55 16.51,41.27 16.51,36.2 16.51,34.92 16.51,33.66 14.61,33.66 12.7,33.66 12.7,41.27 12.7,36.2 12.7,34.92 14.61,42.55 14.61,36.2 14.61,34.92 43.18,43.81 46.99,43.81 45.09,43.81 43.18,42.55 45.09,42.55 46.99,42.55 43.18,41.27 46.99,41.27 46.99,36.2 45.09,36.2 43.18,36.2 43.18,34.92 43.18,33.66 45.09,33.66 45.09,34.92 46.99,34.92 46.99,33.66
  pour Bottom: 1.27,51.75 62.87,51.75 62.87,1.27 1.27,1.27
N$1
  Top 0.152: U4.1 14.92,19.37 15.56,18.73 15.56,18.1 14.92,17.46 12.06,17.46 11.43,18.1 U3.15
N$2
  Top 0.152: U4.2 12.06,18.1 11.43,18.73 6.99,18.73 6.35,19.37 U3.1
N$3
  Top 0.152: U4.3 12.06,16.83 11.43,17.46 6.99,17.46 6.35,18.1 U3.2
N$4
  Top 0.152: U4.4 12.06,15.56 11.43,16.19 6.99,16.19 6.35,16.83 U3.3
N$5
  Top 0.152: U4.5 12.06,14.29 11.43,14.92 6.99,14.92 6.35,15.56 U3.4
N$6
  Top 0.152: U4.6 12.06,13.02 11.43,13.65 6.99,13.65 6.35,14.29 U3.5
N$7
  Top 0.152: U4.7 12.06,11.75 11.43,12.38 6.99,12.38 6.35,13.02 U3.6
N$8
  Top 0.152: U4.8 12.06,10.48 11.43,11.11 6.99,11.11 6.35,11.75 U3.7
N$9
  Top 0.152: R10.1 3.81,44.77 J1.1
N$10
  Top 0.152: U5.15 41.59,18.1 42.86,19.37 U6.1
N$11
  Top 0.152: U5.1 37.47,19.37 38.1,18.73 41.27,18.73 42.55,20 45.4,20 45.72,19.68 45.72,18.41 45.4,18.1 U6.2
N$12
  Top 0.152: U5.2 37.47,18.1 38.1,17.46 42.23,17.46 42.86,16.83 U6.3
N$13
  Top 0.152: U5.3 37.47,16.83 38.1,16.19 41.91,16.19 42.55,15.56 U6.4
N$14
  Top 0.152: U5.4 37.47,15.56 38.1,14.92 41.91,14.92 42.55,14.29 U6.5
N$15
  Top 0.152: U5.5 37.47,14.29 38.1,13.65 41.91,13.65 42.55,13.02 U6.6
N$16
  Top 0.152: U5.6 37.47,13.02 38.1,12.38 41.91,12.38 42.55,11.75 U6.7
N$17
  Top 0.152: U5.7 37.47,11.75 38.1,11.11 41.91,11.11 42.55,10.48 U6.8
N$19
  Top 0.152: R16.1 4.45,35.24 3.81,34.61 3.81,32.7 J1.7
N$20
  Top 0.152: R17.1 4.87,33.12 4.13,32.38 4.13,30.48 J1.8
N$21
  Top 0.152: J2.1 R18.1
N$22
  Top 0.152: J2.2 R19.1
N$23
  Top 0.152: J2.3 R20.1
N$24
  Top 0.152: R15.1 4.76,36.83 2.54,34.61 2.54,33.97 J1.6
N$25
  Top 0.152: J2.4 R21.1
N$26
  Top 0.152: J2.5 R22.1
N$27
  Top 0.152: J2.6 R23.1
N$28
  Top 0.152: R2.1 50.16,42.96 U2.31
N$29
  Top 0.152: J2.7 R24.1
N$30
  Top 0.152: J2.8 R25.1
N$31
  Top 0.152: R26.1 24.34,33.12 25.08,32.38 25.08,30.8 J3.1
N$32
  Top 0.152: R27.1 24.77,35.24 25.4,34.61 25.4,33.02 J3.2
N$33
  Top 0.152: R28.1 24.45,36.83 25.72,35.56 25.72,35.24 J3.3
N$34
  Top 0.152: R29.1 25.08,38.42 J3.4
N$35
  Top 0.152: U1.31 19.36,42.96 R1.1
N$36
  Top 0.152: R30.1 26.04,40.01 J3.5
N$37
  Top 0.152: R31.1 26.99,41.59 J3.6
N$38
  Top 0.152: R32.1 26.67,43.18 J3.7
N$39
  Top 0.152: R33.1 25.72,44.77 J3.8
N$40
  Top 0.152: R11.1 2.86,43.18 J1.2
N$41
  Top 0.152: R12.1 2.54,41.59 J1.3
N$42
  Top 0.152: R13.1 3.49,40.01 J1.4
N$43
  Top 0.152: R14.1 4.45,38.42 J1.5
N$44
  Top 0.152: R56.1 56.83,43.18 J6.7
N$45
  Top 0.152: R57.1 55.88,44.77 J6.8
N$46
  Top 0.152: R55.1 57.15,41.59 J6.6
N$47
  Top 0.152: R54.1 56.2,40.01 J6.5
N$48
  Top 0.152: R53.1 55.24,38.42 J6.4
N$49
  Top 0.152: R52.1 55.24,36.83 56.2,35.88 56.2,34.92 J6.3
N$50
  Top 0.152: R51.1 55.24,35.24 55.88,34.61 55.88,32.7 J6.2
N$51
  Top 0.152: R50.1 54.83,31.22 J6.1
N$52
  Top 0.152: J5.8 R49.1
N$53
  Top 0.152: R48.1 J5.7
N$54
  Top 0.152: J5.6 R47.1
N$55
  Top 0.152: R46.1 J5.5
N$56
  Top 0.152: R45.1 J5.4
N$57
  Top 0.152: R44.1 J5.3
N$58
  Top 0.152: R43.1 J5.2
N$59
  Top 0.152: R42.1 J5.1
N$60
  Top 0.152: R41.1 35.34,33.12 34.92,32.7 34.92,30.8 J4.8
N$61
  Top 0.152: R40.1 34.61,35.24 34.29,34.92 34.29,32.7 J4.7
N$62
  Top 0.152: R39.1 34.61,36.83 33.97,36.2 33.97,34.92 J4.6
N$63
  Top 0.152: R38.1 34.92,38.42 J4.5
N$64
  Top 0.152: R37.1 33.97,40.01 J4.4
N$65
  Top 0.152: R36.1 33.02,41.59 J4.3
N$66
  Top 0.152: R35.1 33.34,43.18 J4.2
N$67
  Top 0.152: R34.1 34.29,44.77 J4.1
ROW0
  Top 0.152: U1.5 9.79,41.01 8.26,42.55 8.26,43.18 6.67,44.77 R10.2
ROW1
  Top 0.152: U1.6 9.49,40.36 6.67,43.18 R11.2
ROW2
  Top 0.152: U1.7 8.87,39.71 6.99,41.59 R12.2
ROW3
  Top 0.152: U1.8 8.25,39.06 7.3,40.01 R13.2
ROW4
  Top 0.152: U1.9 6.57,38.41 R14.2
ROW5
  Top 0.152: U1.10 7.6,37.76 6.67,36.83 R15.2
ROW6
  Top 0.152: U1.11 8.54,37.11 6.99,35.56 6.88,35.56 R16.2
ROW7
  Top 0.152: R17.2 9.37,36.46 U1.12
ROW8
  Top 0.152: U1.13 9.93,35.81 7.62,33.5 7.62,33.02 5.71,31.11 R18.2
ROW9
  Top 0.152: U1.14 10.08,35.16 8.26,33.34 R19.2
ROW10
  Top 0.152: U1.15 10.06,34.51 9.53,33.97 9.53,32.07 10.48,31.11 10.69,31.11 R20.2
ROW11
  Top 0.152: U1.16 10.65,33.64 13.02,31.27 13.23,31.11 R21.2
ROW12
  Top 0.152: U1.17 18.55,33.64 16.03,31.11 15.98,31.11 R22.2
ROW13
  Top 0.152: U1.18 19.15,34.51 19.68,33.97 19.68,32.28 R23.2
ROW14
  Top 0.152: U1.19 19.29,35.16 20.32,34.13 20.32,32.7 20.95,32.07 R24.2
ROW15
  Top 0.152: U1.20 19.59,35.81 20.95,34.45 20.95,33.55 R25.2
ROW16
  Top 0.152: U1.21 19.74,36.46 22.54,33.66 R26.2
ROW17
  Top 0.152: U1.22 20.68,37.11 22.54,35.24 R27.2
ROW18
  Top 0.152: U1.23 20.98,37.76 21.91,36.83 R28.2
ROW19
  Top 0.152: U1.24 R29.2
ROW20
  Top 0.152: U1.25 20.96,39.06 21.91,40.01 R30.2
ROW21
  Top 0.152: U1.26 20.34,39.71 22.23,41.59 R31.2
ROW22
  Top 0.152: U1.27 20.04,40.36 21.91,42.23 21.91,42.55 22.54,43.18 R32.2
ROW23
  Top 0.152: U1.28 20.05,41.01 21.59,42.55 21.59,43.81 22.54,44.77 R33.2
ROW24
  Top 0.152: U2.5 40.27,41.01 38.1,43.18 38.1,43.81 37.15,44.77 R34.2
ROW25
  Top 0.152: U2.6 40.28,40.36 37.47,43.18 R35.2
ROW26
  Top 0.152: U2.7 39.35,39.71 37.47,41.59 R36.2
ROW27
  Top 0.152: U2.8 39.05,39.06 37.78,40.32 37.36,40.32 R37.2
ROW28
  Top 0.152: U2.9 R38.2
ROW29
  Top 0.152: U2.10 38.71,37.76 37.78,36.83 R39.2
ROW30
  Top 0.152: U2.11 39.65,37.11 37.78,35.24 R40.2
ROW31
  Top 0.152: U2.12 40.27,36.46 37.47,33.66 R41.2
ROW32
  Top 0.152: U2.13 40.57,35.81 38.1,33.34 38.1,32.7 36.41,31.01 R42.2
ROW33
  Top 0.152: U2.14 40.72,35.16 38.73,33.18 R43.2
ROW34
  Top 0.152: U2.15 40.54,34.51 40.32,34.29 40.32,31.96 R44.2
ROW35
  Top 0.152: U2.16 41.13,33.69 R45.2
ROW36
  Top 0.152: U2.17 49.03,33.69 R46.2
ROW37
  Top 0.152: U2.18 49.63,34.51 50.16,33.97 50.16,32.38 49,31.22 49,31.11 R47.2
ROW38
  Top 0.152: U2.19 49.77,35.16 50.8,34.13 50.8,33.66 51.44,33.02 R48.2
ROW39
  Top 0.152: U2.20 49.91,35.81 51.44,34.29 51.44,33.66 53.98,31.11 R49.2
ROW40
  Top 0.152: U2.21 50.22,36.46 53.02,33.66 R50.2
ROW41
  Top 0.152: U2.22 50.52,37.11 52.39,35.24 R51.2
ROW42
  Top 0.152: U2.23 51.14,37.76 52.07,36.83 R52.2
ROW43
  Top 0.152: U2.24 R53.2
ROW44
  Top 0.152: U2.25 52.18,39.06 R54.2
ROW45
  Top 0.152: 52.7,41.59 53.02,41.59 | U2.26 51.14,39.71 53.02,41.59 | 53.02,41.59 R55.2
ROW46
  Top 0.152: U2.27 50.2,40.36 53.02,43.18 R56.2
ROW47
  Top 0.152: 52.7,44.77 R57.2 52.07,43.71 52.07,43.02 50.06,41.01 U2.28
ROW_CLEAR  (via drill 0.5)
  Top 0.152: U1.2 10.06,42.96 9.53,43.5 9.53,44.77 13.02,48.26 39.37,48.26 U7.D5 | U2.2 40.54,42.96 40.01,43.5 40.01,45.4 R5.2 40.11,46.77 v40.32,46.99
  Bottom 0.152: v40.32,46.99 41.91,48.58 U7.D5
ROW_CLOCK  (via drill 0.5)
  Top 0.152: v39.05,46.99 39.05,43.81 40.64,42.23 41.05,42.23 U2.3 | U1.3 10.08,42.31 9.21,43.18 9.21,45.09 12.7,48.58 37.15,48.58 U7.D6
  Bottom 0.152: v39.05,46.99 39.05,50.48 U7.D6
ROW_DATA
  Top 0.152: U1.4 10.09,41.66 8.89,42.86 8.89,45.4 12.38,48.9 35.88,48.9 36.51,49.53 U7.D7
ROW_DATA_CASCADE_1
  Top 0.152: U1.29 20.07,41.66 21.27,42.86 21.27,45.09 23.81,47.62 35.88,47.62 38.58,44.93 38.58,43.5 40.41,41.66 U2.4
ROW_LATCH
  Top 0.152: U1.30 20.09,42.31 20.95,43.18 20.95,45.4 23.5,47.94 41.59,47.94 U7.D4 48.26,46.35 48.26,42.55 48.49,42.31 U2.30
SCL
  Top 0.406: JP1.1 JP2.1 60.64,1.27 55.88,1.27 U7.A5
SDA
  Top 0.406: U7.A4 54.61,5.08 JP1.2 JP2.2
VCC  (via drill 0.5)
  Top 0.305: U2.32 49.03,45.86 v49.21,46.04 | U1.32 18.55,43.99 17.14,45.4 C1.1
  Top 0.406: 15.88,45.51 C1.1 | 40.54,19.41 U5.16 | C5.1 38.73,21.27 40.64,19.37 | 40.64,19.37 40.64,19.43 U5.16 | U5.16 40.64,19.37 | 40.64,19.37 40.96,19.37 v40.96,20.64
  Top 0.61: 10.16,19.43 U3.16 | U3.16 10.06,19.37 C3.1 8.15,21.38 6.35,23.18 3.81,23.18 v2.54,24.45 | U3.16 11.37,20.64 17.14,20.64 v20.32,17.46 | C1.1 15.77,46.89 v15.88,46.99 | 46.04,45.51 C2.1 45.94,46.57 v46.04,46.67 | R5.1 41.91,45.51 v41.91,46.67 | v54.61,24.77 50.8,20.95 41.27,20.95 v40.96,20.64
  Bottom 0.61: v2.54,24.45 2.54,26.99 8.57,33.02 8.57,45.4 11.11,47.94 14.92,47.94 v15.88,46.99 | v41.91,46.67 42.86,47.62 45.09,47.62 v46.04,46.67 46.67,46.04 v49.21,46.04 49.21,39.69 55.56,33.34 55.56,25.72 v54.61,24.77 | v40.96,20.64 40.96,13.34 33.34,5.71 32.38,5.71 U7.5V 23.18,8.57 23.18,14.61 v20.32,17.46
VIN1
  Top 0.305: U4.9 12.38,9.21 11.11,7.94 11.11,4.45 JP11.2
  Top 0.61: C7.1 5.61,5.29 JP9.2 8.89,6.03 JP11.2
VIN2
  Top 0.406: JP10.2 40.32,9.21 U6.9
  Top 0.61: JP11.1 37.88,4.13 C8.1 38.52,6.57 JP10.2

### Text on the board
tNames: 0 | 23 | 24 | 47 | 1 | 22 | 25 | 46 | 2 | 21 | 26 | 45 | 3 | 20 | 27 | 44 | 4 | 19 | 28 | 43 | 5 | 18 | 29 | 42 | 6 | 17 | 30 | 41 | 7 | 16 | 31 | 40 | 8 | 9 | 10 | 11 | 12 | 13 | 14 | 15 | 0 | 32 | 33 | 34 | 35 | 36 | 37 | 38 | 39 | 8 | 1 | 9 | 2 | 10 | 3 | 11 | 4 | 12 | 5 | 13 | 6 | 14 | GND | VIN1 | VIN2 | GND | 7 | 15 | VIN1 | VIN2 | SDA | SCL
bNames: v1.1 | LED Driver | Fishhead Industries | (C) 2014